# EAGLE schematic Esquematico1 (EAGLE 9.6.2)
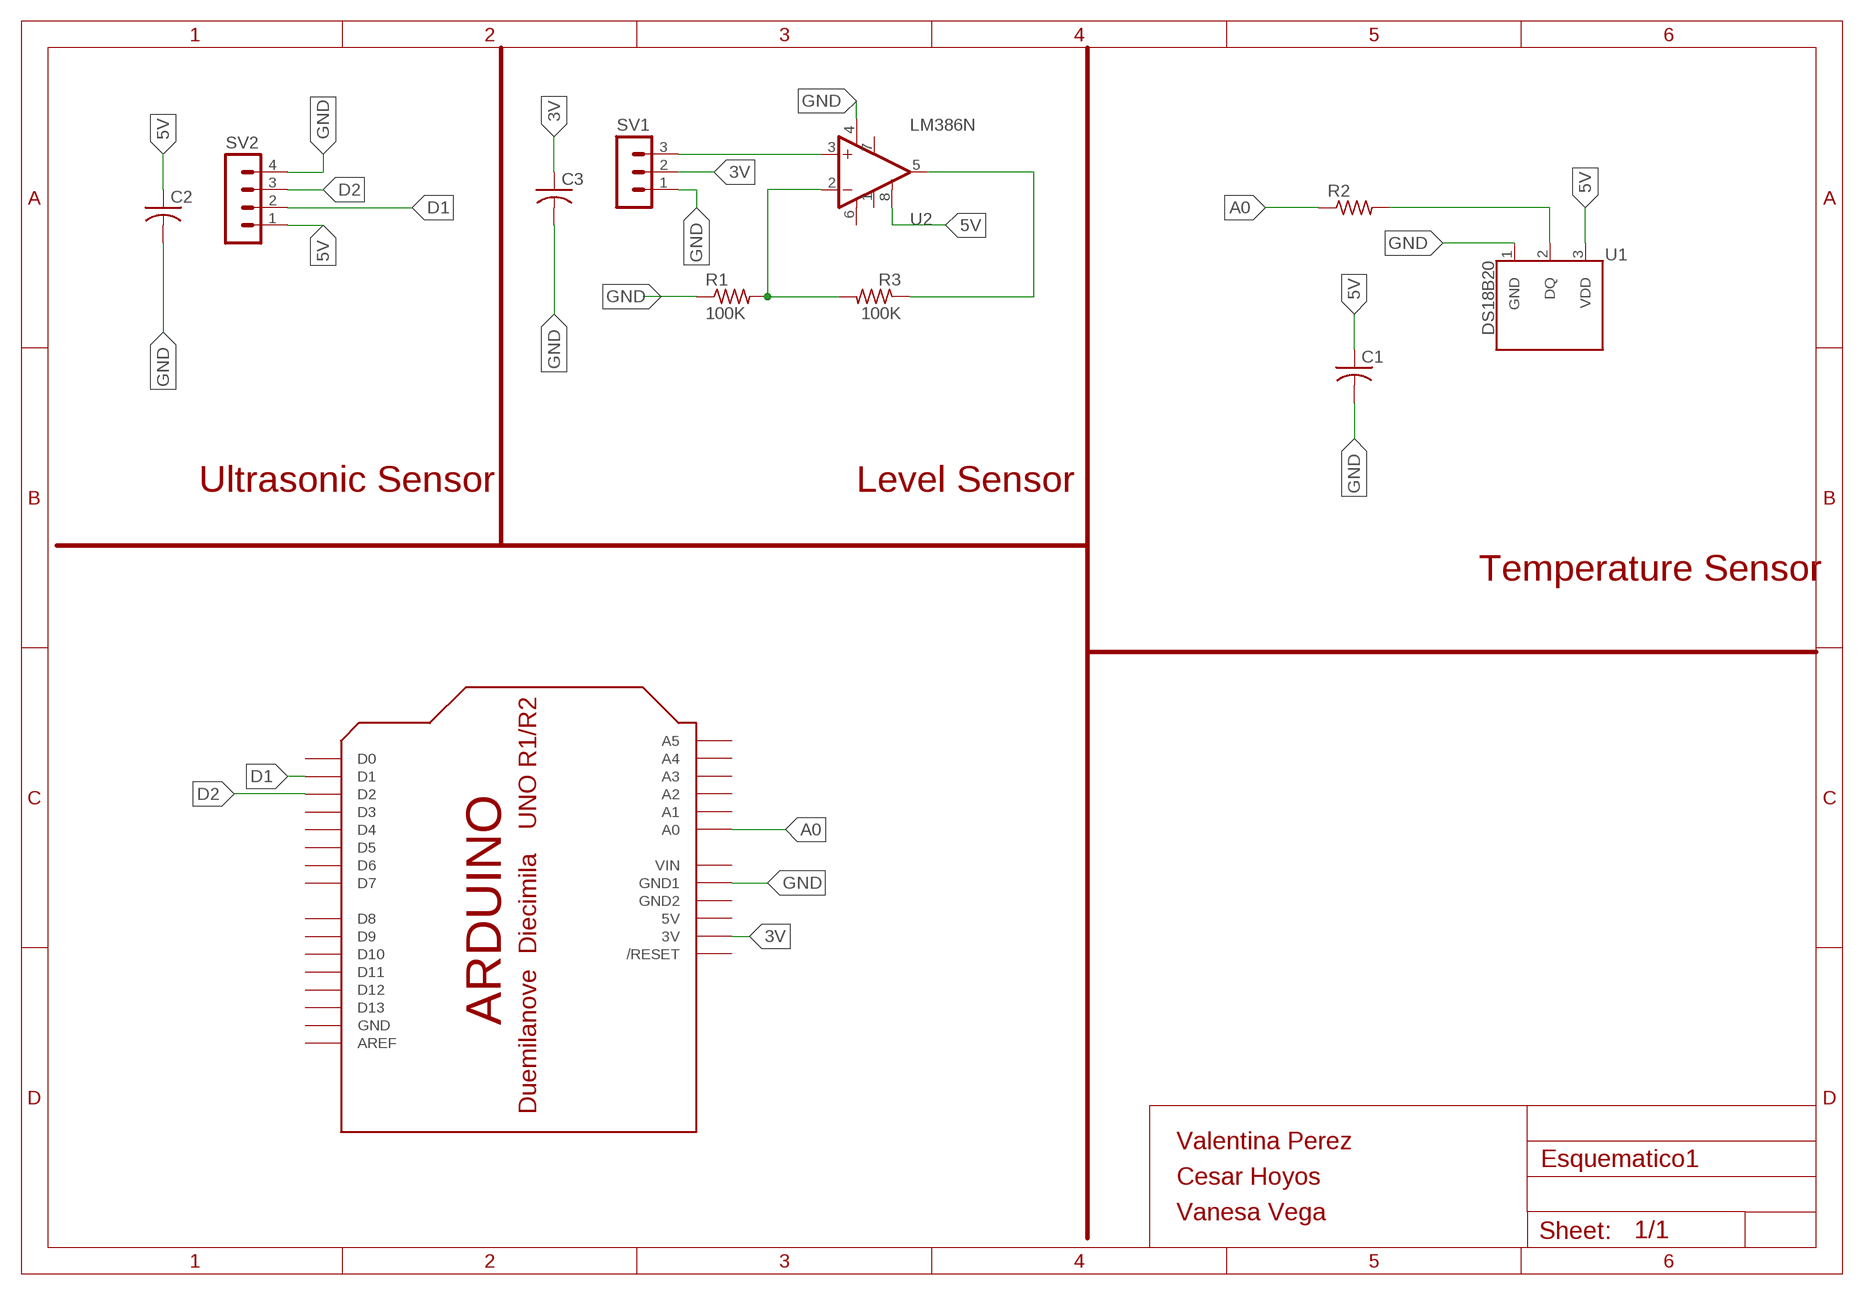
[diagram p0: schematic, sheet 1]

## Parts
C1  C-US025-024X044  [C025-024X044]
C2  C-US025-024X044  [C025-024X044]
C3  C-US025-024X044  [C025-024X044]
R1  100K  R-US_M0805  [M0805]
R2  R-US_M0805  [M0805]
R3  100K  R-US_M0805  [M0805]
SV1  MA03-1  [MA03-1]
SV2  MA04-1  [MA04-1]
U1  DS18B20  [TO-92-AMMO]
U2  LM386N  LM386  [DIP08]
U$1  ARDUINOUNO  [ARDUINO]

## Nets
3V: C3.1 SV1.2 U$1.3V
5V: C1.1 C2.1 SV2.1 U1.3(VDD) U2.8(GAIN)
A0: R2.1 U$1.A0
D1: SV2.2 U$1.D1
D2: SV2.3 U$1.D2
GND: C1.2 C2.2 C3.2 R1.1 SV1.1 SV2.4 U1.1(GND) U2.4(V-) U$1.GND1
N$1: R2.2 U1.2(DQ)
N$2: SV1.3 U2.3(+IN)
N$3: R1.2 R3.2 U2.2(-IN)
N$4: R3.1 U2.5(OUT)
Unconnected: U2.1(GAIN) U2.7(BP) U$1.A1 U$1.A2 U$1.A3 U$1.A4 U$1.A5 U$1.AREF U$1.D0 U$1.D3 U$1.D4 U$1.D5 U$1.D6 U$1.D7 U$1.D8 U$1.D9 U$1.D10 U$1.D11 U$1.D12 U$1.D13 U$1.RESET(/RESET)

## Notes on the sheet
- Ultrasonic Sensor | Level Sensor
- Temperature Sensor
- Valentina Perez
- Cesar Hoyos
- Vanesa Vega

## Power pins joined to a net without a drawn wire
5V: U$1.5V
GND: U$1.GND
GND2: U$1.GND2
V+: U2.6(V+)
VIN: U$1.VIN

## Library data of the parts
C1-C3 = adafruit:C-US: CAPACITOR, American symbol
R1-R3 = adafruit:R-US_: RESISTOR, American symbol
SV1 = con-lstb:MA03-1: PIN HEADER
SV2 = con-lstb:MA04-1: PIN HEADER; OC_FARNELL: unknown; OC_NEWARK: unknown
U1 = SparkFun-Sensors:DS18B20: Dallas/Maxim DS18B20 1-Wire Temperature Sensor The DS18B20 reports degrees C with 9 to 12-bit precision, -55C to 125C (+/-0.5C). Each sensor has a unique 64-Bit Serial number etched into it - allows for a huge number of sensors to be used on one data bus. Datasheet <http://datasheets.maximintegrated.com/en/ds/DS18B20.pdf> SparkFun Products One Wire Digital Temperature Sensor - DS18B20 <https://www.sparkfun.com/products/245> (SEN-00245); STORE_ID: SEN-00245
U2 = SparkFun-IC-Amplifiers:LM386: low voltage audio power amplifier SparkFun Products FabFM Radio Kit <https://www.sparkfun.com/products/11043> (KIT-11043); PROD_ID: IC-10899
U$1 = adafruit:ARDUINO: Arduino Diecimila/Duemilanove Make a shield with ease, this package has all the named pins as well as the two mounting drill holes and an outline of the USB and DC power connector. The outline is on the DIMENSION layer, so if your board house uses it they will cut the outline to match. http://www.ladyada.net/library/pcb/eaglelibrary.html